# Altium schematic sheet SRAM.SchDoc
size A4
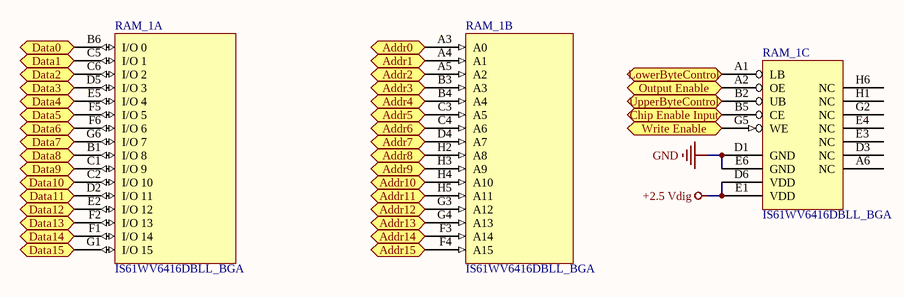
[diagram p0: SRAM.SchDoc]

## Parts
RAM_1  IS61WV6416DBLL_BGA  [TF-BGA 48L 6x8mm]  (parts A,B,C of 3)

## Ports
Addr0 (in), Addr1 (in), Addr2 (in), Addr3 (in), Addr4 (in), Addr5 (in), Addr6 (in), Addr7 (in), Addr8 (in), Addr9 (in), Addr10 (in), Addr11 (in), Addr12 (in), Addr13 (in), Addr14 (in), Addr15 (in), Chip Enable Input (in), Data0 (bidir), Data1 (bidir), Data2 (bidir), Data3 (bidir), Data4 (bidir), Data5 (bidir), Data6 (bidir), Data7 (bidir), Data8 (bidir), Data9 (bidir), Data10 (bidir), Data11 (bidir), Data12 (bidir), Data13 (bidir), Data14 (bidir), Data15 (bidir), LowerByteControl (in), Output Enable (in), UpperByteControl (in), Write Enable (in)

## Nets
+2.5 Vdig: RAM_1.D6(VDD) RAM_1.E1(VDD)
GND: RAM_1.D1(GND) RAM_1.E6(GND)
Addr0: RAM_1.A3(A0) ; port Addr0
Addr1: RAM_1.A4(A1) ; port Addr1
Addr2: RAM_1.A5(A2) ; port Addr2
Addr3: RAM_1.B3(A3) ; port Addr3
Addr4: RAM_1.B4(A4) ; port Addr4
Addr5: RAM_1.C3(A5) ; port Addr5
Addr6: RAM_1.C4(A6) ; port Addr6
Addr7: RAM_1.D4(A7) ; port Addr7
Addr8: RAM_1.H2(A8) ; port Addr8
Addr9: RAM_1.H3(A9) ; port Addr9
Addr10: RAM_1.H4(A10) ; port Addr10
Addr11: RAM_1.H5(A11) ; port Addr11
Addr12: RAM_1.G3(A12) ; port Addr12
Addr13: RAM_1.G4(A13) ; port Addr13
Addr14: RAM_1.F3(A14) ; port Addr14
Addr15: RAM_1.F4(A15) ; port Addr15
Chip Enable Input: RAM_1.B5(CE) ; port Chip Enable Input
Data0: RAM_1.B6(I/O_0) ; port Data0
Data1: RAM_1.C5(I/O_1) ; port Data1
Data2: RAM_1.C6(I/O_2) ; port Data2
Data3: RAM_1.D5(I/O_3) ; port Data3
Data4: RAM_1.E5(I/O_4) ; port Data4
Data5: RAM_1.F5(I/O_5) ; port Data5
Data6: RAM_1.F6(I/O_6) ; port Data6
Data7: RAM_1.G6(I/O_7) ; port Data7
Data8: RAM_1.B1(I/O_8) ; port Data8
Data9: RAM_1.C1(I/O_9) ; port Data9
Data10: RAM_1.C2(I/O_10) ; port Data10
Data11: RAM_1.D2(I/O_11) ; port Data11
Data12: RAM_1.E2(I/O_12) ; port Data12
Data13: RAM_1.F2(I/O_13) ; port Data13
Data14: RAM_1.F1(I/O_14) ; port Data14
Data15: RAM_1.G1(I/O_15) ; port Data15
LowerByteControl: RAM_1.A1(LB) ; port LowerByteControl
Output Enable: RAM_1.A2(OE) ; port Output Enable
UpperByteControl: RAM_1.B2(UB) ; port UpperByteControl
Write Enable: RAM_1.G5(WE) ; port Write Enable

Not connected (* = marked no-connect by the designer): RAM_1 A6(NC) D3(NC) E3(NC) E4(NC) G2(NC) H1(NC) H6(NC)